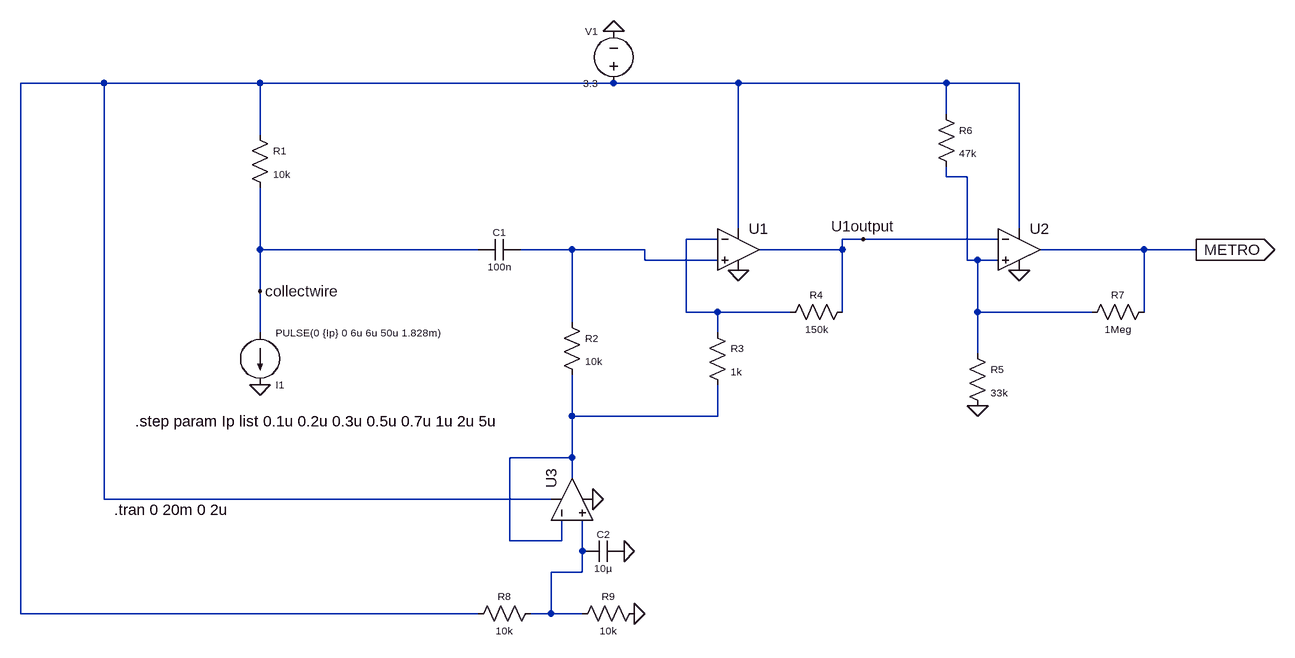
[diagram p0: schematic IR.asc]
IR.asc, the LTspice schematic file:
Version 4.1
SHEET 1 1120 768
WIRE -704 -96 -832 -96
WIRE -464 -96 -704 -96
WIRE 80 -96 -464 -96
WIRE 272 -96 80 -96
WIRE 592 -96 272 -96
WIRE 704 -96 592 -96
WIRE 592 -48 592 -96
WIRE -464 -16 -464 -96
WIRE 592 48 592 32
WIRE 624 48 592 48
WIRE 272 128 272 -96
WIRE 704 128 704 -96
WIRE 240 144 192 144
WIRE 464 144 432 144
WIRE 672 144 464 144
WIRE -464 160 -464 64
WIRE -128 160 -464 160
WIRE 16 160 -64 160
WIRE 128 160 16 160
WIRE 432 160 432 144
WIRE 432 160 304 160
WIRE 896 160 736 160
WIRE 976 160 896 160
WIRE 128 176 128 160
WIRE 240 176 128 176
WIRE 624 176 624 48
WIRE 640 176 624 176
WIRE 672 176 640 176
WIRE -464 224 -464 160
WIRE 192 256 192 144
WIRE 240 256 192 256
WIRE 352 256 240 256
WIRE 432 256 432 160
WIRE 640 256 640 176
WIRE 816 256 640 256
WIRE 896 256 896 160
WIRE 16 272 16 160
WIRE -464 288 -464 224
WIRE 240 288 240 256
WIRE 640 320 640 256
WIRE 16 416 16 352
WIRE 240 416 240 368
WIRE 240 416 16 416
WIRE 16 480 16 416
WIRE 16 480 -80 480
WIRE 16 512 16 480
WIRE -704 544 -704 -96
WIRE -16 544 -704 544
WIRE -80 608 -80 480
WIRE 0 608 0 576
WIRE 0 608 -80 608
WIRE 32 624 32 576
WIRE 32 656 32 624
WIRE 32 656 -16 656
WIRE -832 720 -832 -96
WIRE -128 720 -832 720
WIRE -16 720 -16 656
WIRE -16 720 -48 720
WIRE 32 720 -16 720
FLAG 80 -176 0
FLAG -464 368 0
FLAG 272 192 0
FLAG 704 192 0
FLAG 640 400 0
FLAG 976 160 METRO
IOPIN 976 160 Out
FLAG 464 144 U1output
FLAG -464 224 collectwire
FLAG 48 544 0
FLAG 112 720 0
FLAG 96 624 0
SYMBOL voltage 80 -80 R180
WINDOW 0 24 96 Left 1
WINDOW 3 24 16 Left 1
SYMATTR InstName V1
SYMATTR Value 3.3
SYMBOL cap -64 144 R90
WINDOW 0 0 32 VBottom 1
WINDOW 3 32 32 VTop 1
SYMATTR InstName C1
SYMATTR Value 100n
SYMBOL current -464 288 R0
WINDOW 0 24 80 Left 1
WINDOW 3 24 0 Left 1
WINDOW 123 0 0 Left 0
WINDOW 39 0 0 Left 0
SYMATTR InstName I1
SYMATTR Value PULSE(0 {Ip} 0 6u 6u 50u 1.828m)
SYMBOL res -480 -32 R0
WINDOW 0 36 40 Left 1
WINDOW 3 36 76 Left 1
SYMATTR InstName R1
SYMATTR Value 10k
SYMBOL res 0 256 R0
WINDOW 0 36 40 Left 1
WINDOW 3 36 76 Left 1
SYMATTR InstName R2
SYMATTR Value 10k
SYMBOL res 224 272 R0
WINDOW 0 36 40 Left 1
WINDOW 3 36 76 Left 1
SYMATTR InstName R3
SYMATTR Value 1k
SYMBOL res 448 240 R90
WINDOW 0 0 56 VBottom 1
WINDOW 3 32 56 VTop 1
SYMATTR InstName R4
SYMATTR Value 150k
SYMBOL OpAmps\\UniversalOpAmp2 704 160 R0
SYMATTR InstName U2
SYMATTR Value2 Avol=1Meg GBW=1Meg Slew=4Meg
SYMBOL res 624 304 R0
WINDOW 0 36 40 Left 1
WINDOW 3 36 76 Left 1
SYMATTR InstName R5
SYMATTR Value 33k
SYMBOL res 576 -64 R0
WINDOW 0 36 40 Left 1
WINDOW 3 36 76 Left 1
SYMATTR InstName R6
SYMATTR Value 47k
SYMBOL res 912 240 R90
WINDOW 0 0 56 VBottom 1
WINDOW 3 32 56 VTop 1
SYMATTR InstName R7
SYMATTR Value 1Meg
SYMBOL OpAmps\\UniversalOpAmp2 272 160 R0
SYMATTR InstName U1
SYMATTR Value2 Avol=1Meg GBW=10Meg Slew=7Meg
SYMBOL OpAmps\\UniversalOpAmp2 16 544 R270
SYMATTR InstName U3
SYMBOL res -32 704 R90
WINDOW 0 0 56 VBottom 1
WINDOW 3 32 56 VTop 1
SYMATTR InstName R8
SYMATTR Value 10k
SYMBOL res 128 704 R90
WINDOW 0 0 56 VBottom 1
WINDOW 3 32 56 VTop 1
SYMATTR InstName R9
SYMATTR Value 10k
SYMBOL cap 96 608 R90
WINDOW 0 0 32 VBottom 1
WINDOW 3 32 32 VTop 1
SYMATTR InstName C2
SYMATTR Value 10µ
TEXT -688 560 Left 2 !.tran 0 20m 0 2u
TEXT -656 424 Left 2 !.step param Ip list 0.1u 0.2u 0.3u 0.5u 0.7u 1u 2u 5u

The netlist it stands for:
* IR.asc
V1 N001 0 3.3
C1 N004 collectwire 100n
I1 collectwire 0 PULSE(0 {Ip} 0 6u 6u 50u 1.828m)
R1 N001 collectwire 10k
R2 N004 N005 10k
R3 N003 N005 1k
R4 U1output N003 150k
X§U2 N002 U1output N001 0 METRO level2 Avol=1Meg GBW=1Meg Slew=4Meg Ilimit=25m Rail=0 Vos=0 En=0 Enk=0 In=0 Ink=0 Rin=500Meg  ; pins In+ In- V+ V- OUT
R5 N002 0 33k
R6 N001 N002 47k
R7 METRO N002 1Meg
X§U1 N004 N003 N001 0 U1output level2 Avol=1Meg GBW=10Meg Slew=7Meg Ilimit=25m Rail=0 Vos=0 En=0 Enk=0 In=0 Ink=0 Rin=500Meg  ; pins In+ In- V+ V- OUT
X§U3 N006 N005 N001 0 N005 level2 Avol=1Meg GBW=10Meg Slew=10Meg Ilimit=25m Rail=0 Vos=0 En=0 Enk=0 In=0 Ink=0 Rin=500Meg  ; pins In+ In- V+ V- OUT
R8 N006 N001 10k
R9 0 N006 10k
C2 0 N006 10µ
.tran 0 20m 0 2u
.step param Ip list 0.1u 0.2u 0.3u 0.5u 0.7u 1u 2u 5u
.lib UniversalOpAmp2.lib
.backanno
.end